# Altium schematic sheet SensePair.SchDoc
size A4; SheetNumber: 3; SheetTotal: 6
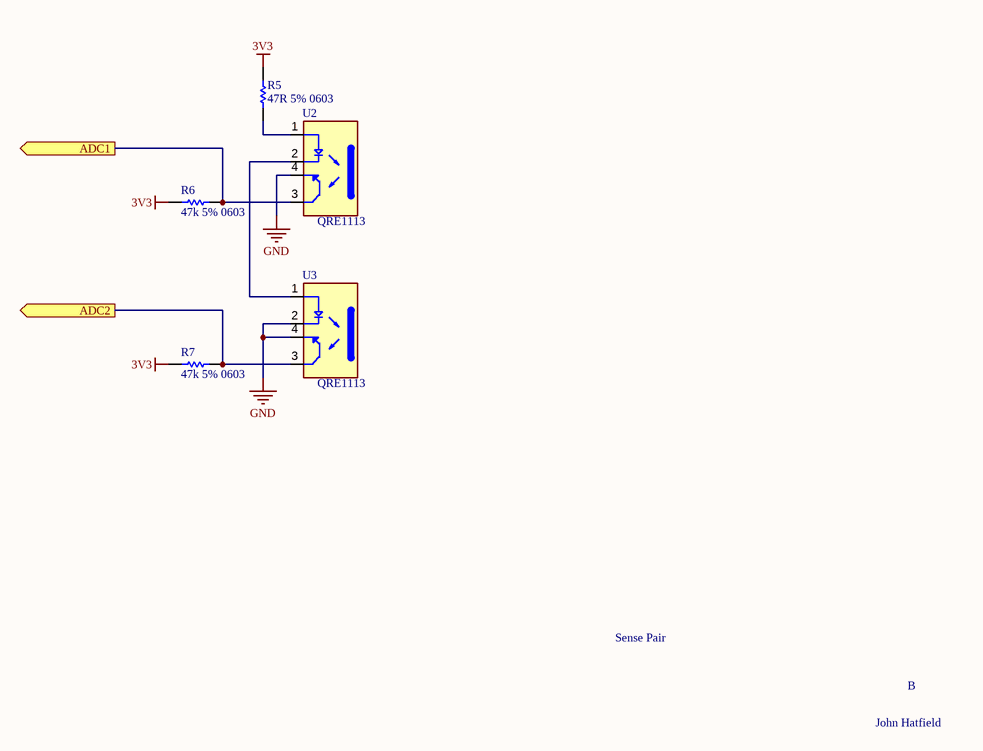
[diagram p0: SensePair.SchDoc]

## Parts
R5  47R 5% 0603  [Res_ThinFilm_0603]
R6  47k 5% 0603  [Res_ThinFilm_0603]
R7  47k 5% 0603  [Res_ThinFilm_0603]
U2  QRE1113  [DIP400W50P180L360H200Q4]
U3  QRE1113  [DIP400W50P180L360H200Q4]

## Ports
ADC1 (out), ADC2 (out)

## Nets
3V3: R5.2 R6.1 R7.1
GND: U2.4(ET) U3.2(C) U3.4(ET)
ADC1: R6.2 U2.3(CT) ; port ADC1
ADC2: R7.2 U3.3(CT) ; port ADC2
NetR5_1: R5.1 U2.1(A)
NetU2_2: U2.2(C) U3.1(A)

## Notes on the sheet
- Sense Pair
- B
- John Hatfield
- THIS DOCUMENT AND THE DATA DISCLOSED HEREIN OR
- HEREWITH IS THE PROPERTY OF ALTIUM LIMITED AND MAY
- DWG NO:
- REVISION
- REV:
- DESCRIPTION
- DATE
- APPROVED
- BE FREELY DISTRIBUTED IN WHOLE. NO RIGHTS ARE
- RESERVED OR EXPRESS OR IMPLIED WARANTEE GIVEN.
- ENG:
- APPROVALS
- PROJECT
- DSN:
- CHK:
- REFERENCE DOCUMENTS
- PROJECT REVISION:
- TITLE
- DOCUMENT REVISION:
- DESIGN ITEM:
- BOM:
- FAB DWG:
- PCB DWG:
- ASSY DWG:
- SCALE:
- A3
- SIZE
- CAGE CODE
- FILE NAME
- DWG NO.
- SHEET
- OF
- REV

## Library data of the parts
R5 = 47R 5% 0603: Resistor, SMD, 47R, 0.1W, 5%, 0603
R6 R7 = 47k 5% 0603: Resistor, SMD, 47k, 0.1W, 5%, 0603
U2 U3 = QRE1113: Reflective Optical Sensor 0.197 _5mm_ 4-DIP _0.157, 4.00mm_; MF: ON Semiconductor; Availability: Unavailable; Package: DIP-4 ON Semiconductor; MP: QRE1113; Value: *; SnapEDA_Link: https://www.snapeda.com/parts/QRE1113/ON%20Semiconductor/view-part/2391104/?ref=snap; Price: None